# EasyEDA Pro project ProProject_ESP32S3-LVGL-DevelopmentBoard.epro

# Schematic Schematic1
Create Date: 2023-11-24; Page Name: P1; Project Name: ESP32-TFT3.2开发板; Schematic Name: Schematic1; Update Date: 2024-04-12; Company: 嘉立创EDA; Page Size: A4; Version: V1.0
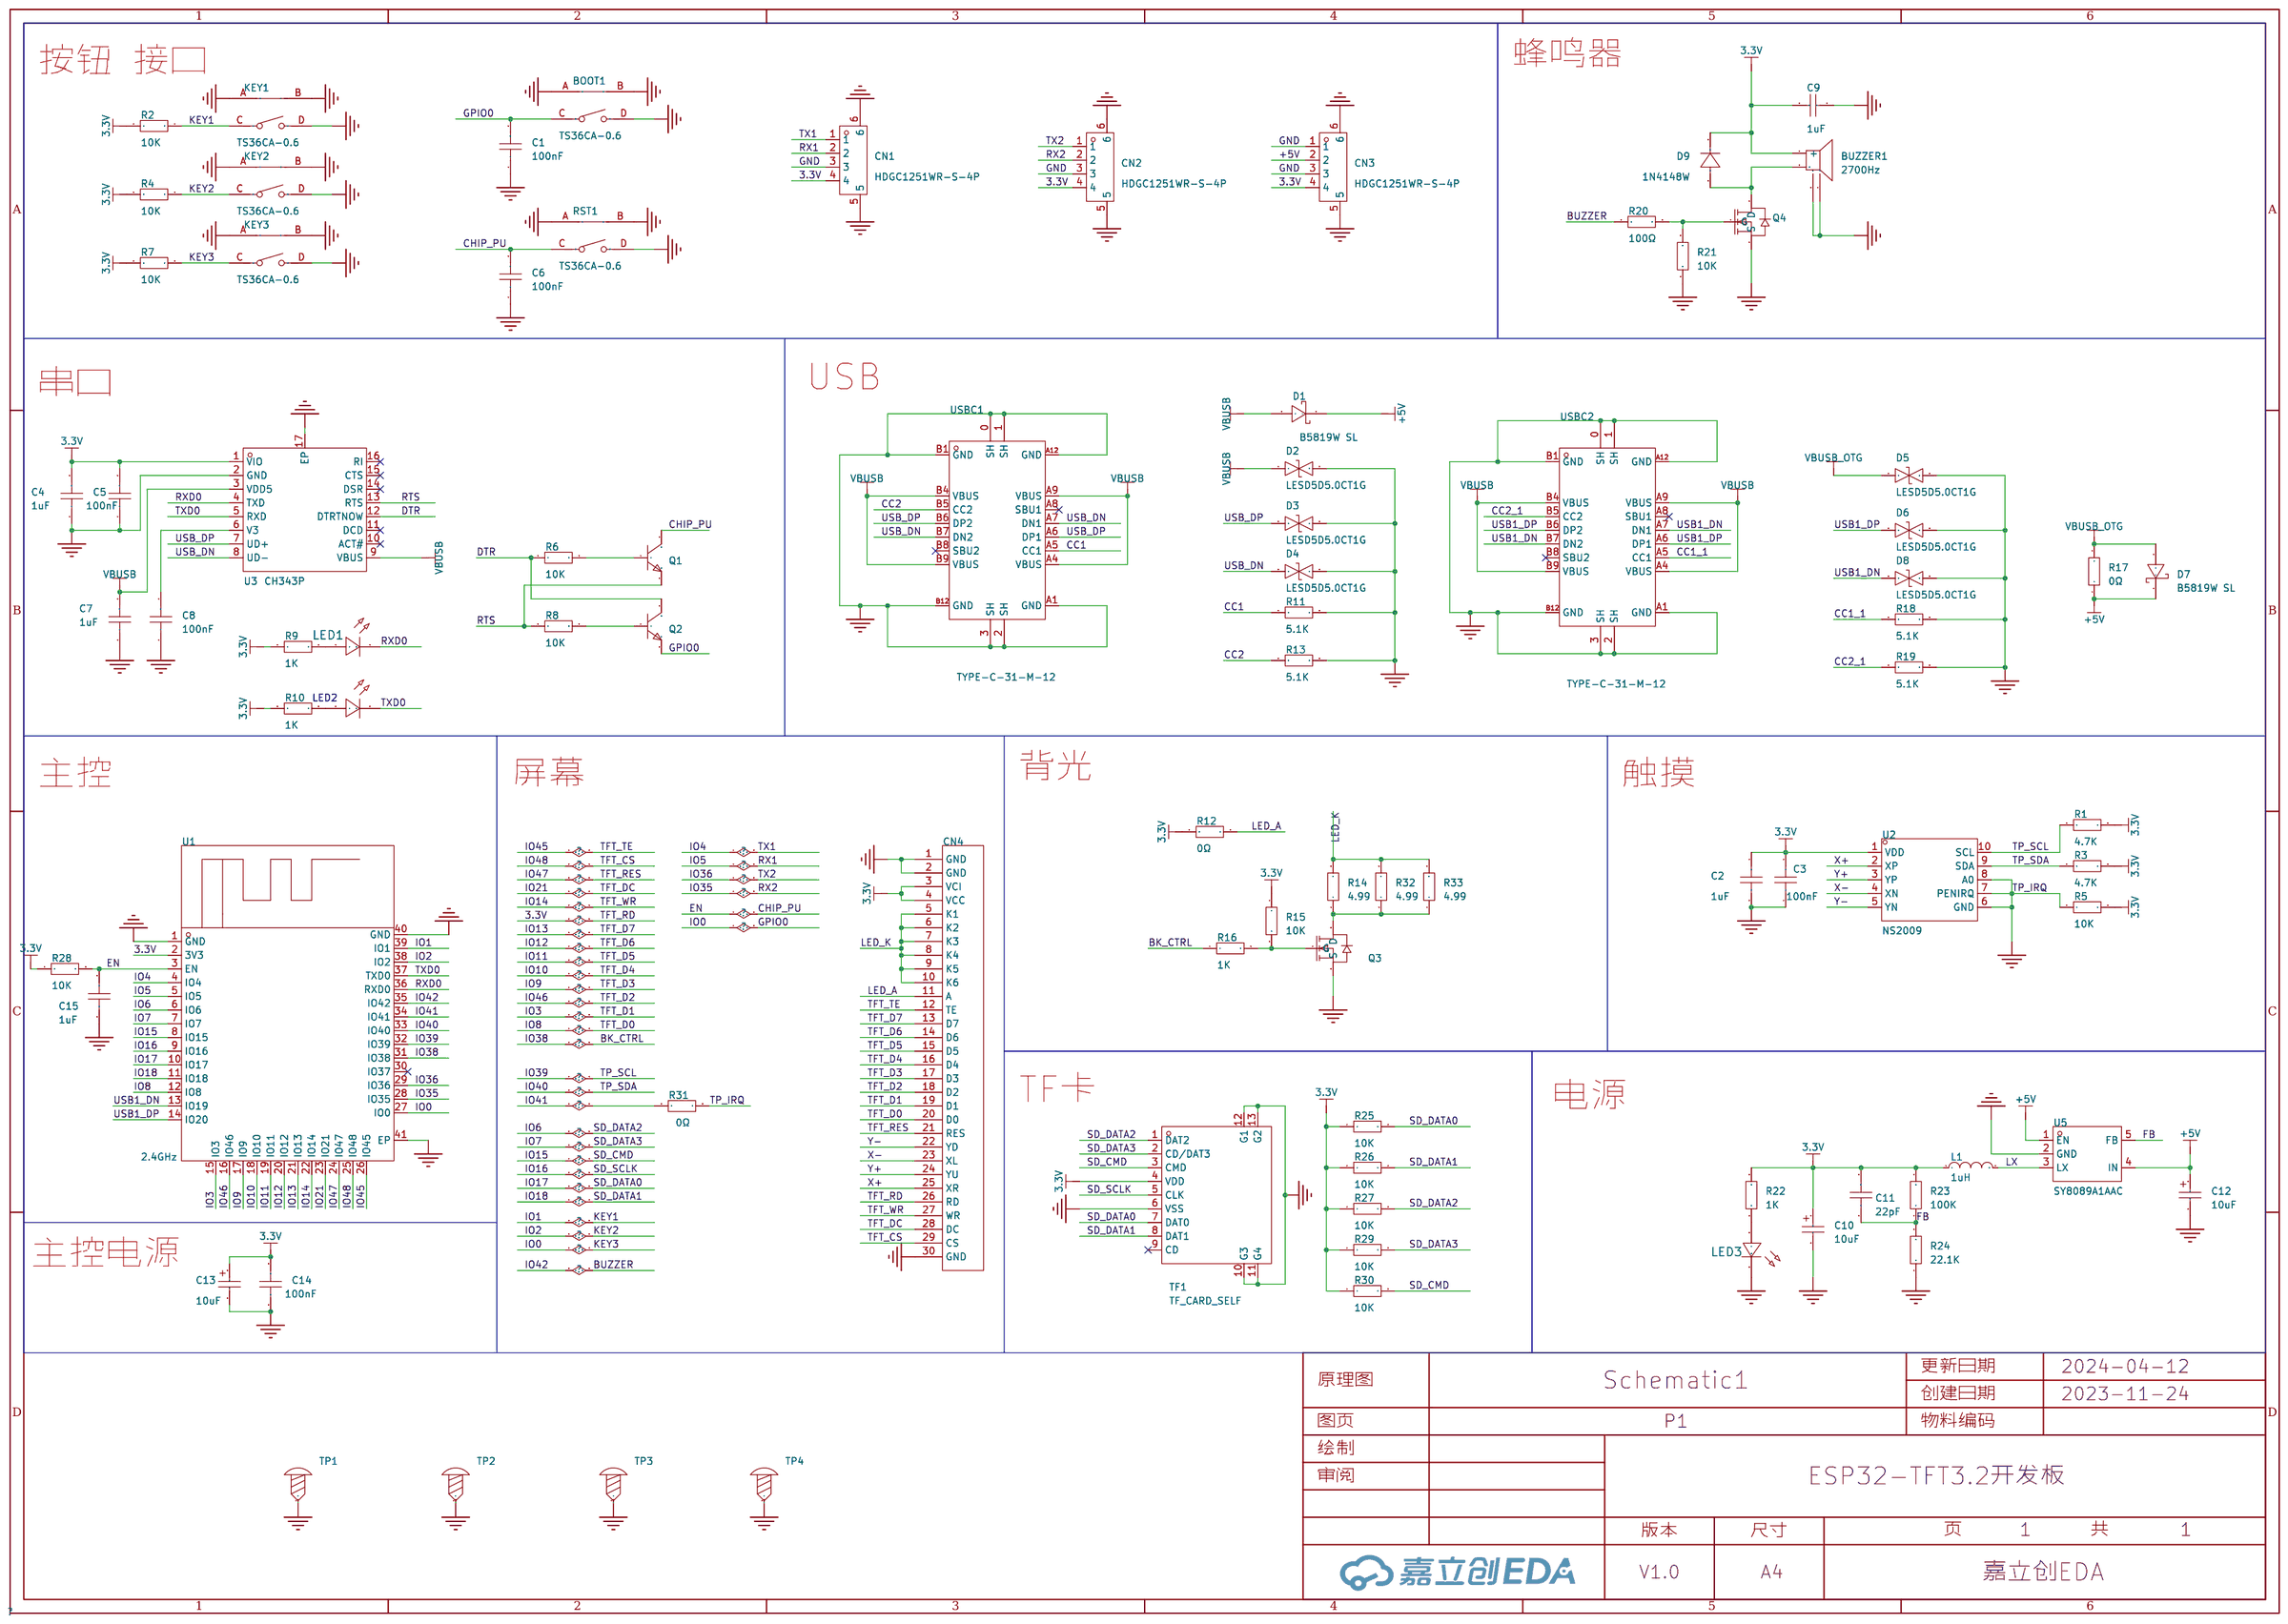
[diagram p0: schematic sheet]

## Parts
BOOT1  TS36CA-0.6  [SW-SMD_TS36CA]
BUZZER1  2700Hz  [BUZ-SMD_4P-L8.5-W8.5-P8.50-BR]
C1  100nF  [C0603]
C2  1uF  [C0603]
C3  100nF  [C0603]
C4  1uF  [C0603]
C5  100nF  [C0603]
C6  100nF  [C0603]
C7  1uF  [C0603]
C8  100nF  [C0603]
C9  1uF  [C0603]
C10  10uF  [CAP-SMD_L3.2-W1.6-RD-C7171]
C11  22pF  [C0603]
C12  10uF  [CAP-SMD_L3.2-W1.6-RD-C7171]
C13  10uF  [CAP-SMD_L3.2-W1.6-RD-C7171]
C14  100nF  [C0603]
C15  1uF  [C0603]
CN1  HDGC1251WR-S-4P  [CONN-SMD_4P-P1.25_HDGC-HDGC1251WR-S-4P]
CN2  HDGC1251WR-S-4P  [CONN-SMD_4P-P1.25_HDGC-HDGC1251WR-S-4P]
CN3  HDGC1251WR-S-4P  [CONN-SMD_4P-P1.25_HDGC-HDGC1251WR-S-4P]
CN4  -  [FPC032MRA003-V2]
D1  B5819W SL  [SOD-123_L2.7-W1.6-LS3.7-RD-1]
D2  LESD5D5.0CT1G  [SOD-523_L1.2-W0.8-LS1.6-BI]
D3  LESD5D5.0CT1G  [SOD-523_L1.2-W0.8-LS1.6-BI]
D4  LESD5D5.0CT1G  [SOD-523_L1.2-W0.8-LS1.6-BI]
D5  LESD5D5.0CT1G  [SOD-523_L1.2-W0.8-LS1.6-BI]
D6  LESD5D5.0CT1G  [SOD-523_L1.2-W0.8-LS1.6-BI]
D7  B5819W SL  [SOD-123_L2.7-W1.6-LS3.7-RD-1]
D8  LESD5D5.0CT1G  [SOD-523_L1.2-W0.8-LS1.6-BI]
D9  1N4148W  [SOD-123_L2.7-W1.6-LS3.7-RD-1]
KEY1  TS36CA-0.6  [SW-SMD_TS36CA]
KEY2  TS36CA-0.6  [SW-SMD_TS36CA]
KEY3  TS36CA-0.6  [SW-SMD_TS36CA]
L1  1uH  [IND-SMD_L2.5-W2.0-B]
LED1  -  [LED_0603]
LED2  -  [LED_0603]
LED3  -  [LED_0603]
Q1  -  [S8050_SOT-23]
Q2  -  [S8050_SOT-23]
Q3  -  [SOT-23-3_L2.9-W1.3-P1.90-LS2.4-BR]
Q4  -  [SOT-23-3_L2.9-W1.3-P1.90-LS2.4-BR]
R1  4.7K  [R0603]
R2  10K  [R0603]
R3  4.7K  [R0603]
R4  10K  [R0603]
R5  10K  [R0603]
R6  10K  [R0603]
R7  10K  [R0603]
R8  10K  [R0603]
R9  1K  [R0603]
R10  1K  [R0603]
R11  5.1K  [R0603]
R12  0Ω  [R0603]
R13  5.1K  [R0603]
R14  4.99  [R0603]
R15  10K  [R0603]
R16  1K  [R0603]
R17  0Ω  [R0603]
R18  5.1K  [R0603]
R19  5.1K  [R0603]
R20  100Ω  [R0603]
R21  10K  [R0603]
R22  1K  [R0603]
R23  100K  [R0603]
R24  22.1K  [R0603]
R25  10K  [R0603]
R26  10K  [R0603]
R27  10K  [R0603]
R28  10K  [R0603]
R29  10K  [R0603]
R30  10K  [R0603]
R31  0Ω  [R0603]
R32  4.99  [R0603]
R33  4.99  [R0603]
RST1  TS36CA-0.6  [SW-SMD_TS36CA]
TF1  TF_CARD_SELF  [TF-SMD_TF-15-15]
TP1  -  [M3螺丝]
TP2  -  [M3螺丝]
TP3  -  [M3螺丝]
TP4  -  [M3螺丝]
U1  2.4GHz  [WIFIM-SMD_ESP32-S3-WROOM-1-N8]
U2  NS2009  [MSOP-10_L3.0-W3.0-P0.50-LS5.0-BL]
U3  CH343P  [TQFN-16_L3.0-W3.0-P0.50-BL-EP1.7]
U5  SY8089A1AAC  [TSOT-23-5_L2.9-W1.6-P0.95-LS2.8-BR]
USBC1  TYPE-C-31-M-12  [USB-C_SMD-TYPE-C-31-M-12]
USBC2  TYPE-C-31-M-12  [USB-C_SMD-TYPE-C-31-M-12]

## Library data of the parts
BOOT1 KEY1-KEY3 RST1 = TS36CA-0.6: 触点电流:50mA;额定电压(DC):12V;绝缘电阻:100MΩ;电路结构:单刀单掷;安装方式:卧贴;按钮形状:矩形按钮;按钮/盖帽颜色:黑色;作用力:250gf@±50gf;机械寿命:30000;工作温度:-20℃~+70℃;引脚样式:SMD接片;开关高度:3.5mm;; LCSC Part Name: 轻触开关 3*6*3.5侧按 直径0.6定位柱 白体黑头 250力度; Supplier Part: C2681481; Manufacturer: SHOU HAN(首韩); Supplier Footprint: SMD; JLCPCB Part Class: 扩展库; Datasheet: https://atta.szlcsc.com/upload/public/pdf/source/20210122/C2681481_EC49E45AE97AC1474E58FB36E84EF19B.pdf; Supplier: LCSC; Contact Current: 50mA; Voltage Rating (DC): 12V; Insulation Resistance: 100MΩ; Circuit: 单刀单掷; Mounting Style: 卧贴; Actuator Style: 矩形按钮; Actuator/Cap Color: 黑色; Operating Force: 250gf@±50gf; Mechanical Life: 30000; Operating Temperature: -20℃~+70℃; Pin Style: SMD接片; Switch Height: 3.5mm
BUZZER1 = MLT-8530_C94599: 驱动方式:无源(外部驱动);构造类型:电磁式;额定电压:3.6V;工作电压:2.5V~4.5V;频率:2700Hz;声压(SPL):80dB@5V,10cm;长度:8.5mm;宽度:8.5mm;高度:3.3mm;; LCSC Part Name: MLT-8530; Supplier Part: C94599; Manufacturer: 华能; Manufacturer Part: MLT-8530; Supplier Footprint: SMD; JLCPCB Part Class: 扩展库; Datasheet: https://atta.szlcsc.com/upload/public/pdf/source/20170522/1495448322339.pdf; Supplier: LCSC; Oscillator Circuit: 无源(外部驱动); Technology Type: 电磁式; Rated Voltage: 3.6V; Operating Voltage: 2.5V~4.5V; Sound Pressure Level (SPL): 80dB@5V,10cm; Length: 8.5mm; Width: 8.5mm; Height: 3.3mm
C1-C8 C11 C15 = CAP_0603: Supplier Footprint: 0603
C9 = CL10A105KO8NNNC: 容值:1uF;精度:±10%;额定电压:16V;材质(温度系数):X5R;; LCSC Part Name: 1uF ±10% 16V; Supplier Part: C1592; Manufacturer: SAMSUNG(三星); Supplier Footprint: 0603; JLCPCB Part Class: 扩展库; Datasheet: https://atta.szlcsc.com/upload/public/pdf/source/20220919/9FBE606BE0D9532D730F292EB26DC5BB.pdf; Supplier: LCSC; Tolerance: ±10%; Voltage Rated: 16V; Temperature Coefficient: X5R
C10 C12 C13 = TAJA106K016RNJ: 容值:10uF;精度:±10%;额定电压:16V;等效串联电阻:3Ω@100kHz;; LCSC Part Name: 10uF ±10% 16V; Supplier Part: C7171; Manufacturer: Kyocera AVX; Supplier Footprint: CASE-A-3216; JLCPCB Part Class: 基础库; Datasheet: https://atta.szlcsc.com/upload/public/pdf/source/20160107/1457707748093.pdf; Supplier: LCSC; Tolerance: ±10%; Rated Voltage: 16V; Equivalent Series Resistance(ESR): 3Ω@100kHz; Operating Temperature: -55℃~+125℃
C14 = CC0603KRX7R9BB104: 容值:100nF;精度:±10%;额定电压:50V;材质(温度系数):X7R;; LCSC Part Name: 100nF ±10% 50V; Supplier Part: C14663; Manufacturer: YAGEO(国巨); Supplier Footprint: 0603; JLCPCB Part Class: 基础库; Datasheet: https://atta.szlcsc.com/upload/public/pdf/source/20180910/C282072_33301C7F631E79921B82A8DAC6BCC5B3.pdf; Supplier: LCSC; Tolerance: ±10%; Voltage Rated: 50V; Temperature Coefficient: X7R
CN1-CN3 = HDGC1251WR-S-4P: 插针结构:1x4P;间距:1.25mm;公母:公;安装方式:卧贴;行距:-;排数:1;每排PIN数:4;参考系列:-;额定电流:1A;工作温度范围:-25℃~+70℃;; LCSC Part Name: 1x4P 间距:1.25mm 卧贴; Supplier Part: C2936205; Manufacturer: HDGC(华德共创); Supplier Footprint: SMD,P=1.25mm; JLCPCB Part Class: 扩展库; Datasheet: https://atta.szlcsc.com/upload/public/pdf/source/20211224/39B2CD9909BA84C441A1A286C5C28FE5.pdf; Supplier: LCSC; Pins Structure: 1x4P; Pitch: 1.25mm; Gender: 公; Mounting Style: 卧贴; Number of Rows: 1; Number of PINs Per Row: 4; Current Rating (Max): 1A; Operating Temperature Range: -25℃~+70℃
CN4 = FPC032MRA003-V2: 3.2 寸液晶屏 30 Pin, r61581  320*480 MCU 8 Bits 带电阻屏; Check: false
D1 D7 = B5819W SL: 直流反向耐压(Vr):40V;平均整流电流(Io):1A;正向压降(Vf):600mV@1A;; LCSC Part Name: 40V 1A 600mV@1A; Supplier Part: C8598; Manufacturer: CJ(江苏长电/长晶); Supplier Footprint: SOD-123; JLCPCB Part Class: 基础库; Datasheet: https://atta.szlcsc.com/upload/public/pdf/source/20170217/1487301580783.pdf; Supplier: LCSC; Reverse Voltage (Vr): 40V; Average Rectified Current (Io): 1A; Forward Voltage (Vf@If): 600mV@1A
D2-D6 D8 = LESD5D5.0CT1G: 极性:双向;反向截止电压(Vrwm):5V;击穿电压(VBR):5.6V;钳位电压(Vc)@Ipp:18.6V;; LCSC Part Name: 双向ESD; Supplier Part: C383211; Manufacturer: LRC(乐山无线电); Supplier Footprint: SOD-523; JLCPCB Part Class: 扩展库; Datasheet: https://atta.szlcsc.com/upload/public/pdf/source/20190807/C383211_633DF4B4E2C161403226E5235FE33A1C.pdf; Supplier: LCSC; Polarity: 双向; Reverse Stand-Off Voltage (Vrwm): 5V; Breakdown Voltage (VBR): 5.6V; Peak Pulse Current(Ipp)@8/20us: 9.4A; Clamping Voltage@Ipp: 18.6V
D9 = 1N4148W: 二极管配置:-;功率:500mW;直流反向耐压(Vr):-;平均整流电流(Io):150mA;正向压降(Vf):1.25V@100mA;反向电流(Ir):5uA@75V;反向恢复时间(trr):4ns;工作温度:+150℃@(Tj);; LCSC Part Name: 150mA 4ns; Supplier Part: C2892570; Manufacturer: YONGYUTAI(永裕泰); Supplier Footprint: SOD-123; JLCPCB Part Class: 扩展库; Datasheet: https://atta.szlcsc.com/upload/public/pdf/source/20210906/424708ED2E76C29D36F058AA2585E916.pdf; Supplier: LCSC; Power Dissipation: 500mW; Average Rectified Current (Io): 150mA; Forward Voltage (Vf@If): 1.25V@100mA; Reverse Leakage Current: 5uA@75V; Reverse Recovery Time (trr): 4ns; Operating Temperature: +150℃@(Tj)
L1 = PIM252010-1R0MTS00: 类型:-;电感值:1uH;精度:±20%;额定电流:4.1A;饱和电流(Isat):-;; LCSC Part Name: 1uH ±20% 4.1A 30mΩ; Supplier Part: C2986790; Manufacturer: FH(风华); Supplier Footprint: SMD,2.5x2x1mm; JLCPCB Part Class: 扩展库; Datasheet: https://atta.szlcsc.com/upload/public/pdf/source/20220412/F9C223B3E3BB425973BA14529C55B246.pdf; Supplier: LCSC; Tolerance: ±20%; Rated Current: 4.1A; DC Resistance (DCR): 30mΩ
LED1 LED3 = LED_0603-R: Supplier Footprint: 0603
LED2 = LED_0603-G: Supplier Footprint: 0603
Q1 Q2 = S8050_SOT_NPN: Supplier Footprint: SOT-23
Q3 Q4 = AO3400A_N: 类型:N沟道;漏源电压(Vdss):30V;连续漏极电流(Id):5.2A;功率(Pd):1W;导通电阻(RDS(on)@Vgs,Id):35mΩ@10V,5A;阈值电压(Vgs(th)@Id):1.5V@250μA;; Supplier Footprint: SOT-23; Supplier Part: C700953
R1-R19 R22-R33 = Res_0603: Supplier Footprint: 0603
R20 = RC0603FR-07100RL: 电阻类型:厚膜电阻;阻值:100Ω;精度:±1%;功率:100mW;; LCSC Part Name: 100Ω ±1% 100mW; Supplier Part: C105588; Manufacturer: YAGEO(国巨); Supplier Footprint: 0603; JLCPCB Part Class: 扩展库; Datasheet: https://atta.szlcsc.com/upload/public/pdf/source/20170428/1493376742308.pdf; Supplier: LCSC; Type: 厚膜电阻; Tolerance: ±1%; Power(Watts): 100mW; Temperature Coefficient: ±100ppm/℃; Overload Voltage (Max): 75V; Operating Temperature Range: -55℃~+155℃
R21 = 0603WAF1002T5E: 阻值:10kΩ;精度:±1%;功率:100mW;温度系数:±100ppm/℃;电阻类型:厚膜电阻;; LCSC Part Name: 10kΩ ±1% 100mW 厚膜电阻; Supplier Part: C25804; Manufacturer: UNI-ROYAL(厚声); Supplier Footprint: 0603; JLCPCB Part Class: 基础库; Datasheet: https://atta.szlcsc.com/upload/public/pdf/source/20200306/C422600_1E6D84923E4A46A82E41ADD87F860B5C.pdf; Supplier: LCSC; Tolerance: ±1%; Power(Watts): 100mW; Overload Voltage (Max): 75V; Temperature Coefficient: ±100ppm/℃; Type: 厚膜电阻; Operating Temperature Range: -55℃~+155℃
TF1 = TF_CARD_SELF: Supplier Part: C9900010414; Supplier Footprint: TFCARD; JLCPCB Part Class: 扩展库; Datasheet: https://atta.szlcsc.comnull; Supplier: LCSC
TP1-TP4 = M3螺丝: Supplier Footprint: 插件
U1 = ESP32-S3-WROOM-1-N8: 核心处理器:ESP32-S3芯片;频率:2.4GHz;; LCSC Part Name: 通用型Wi-Fi+低功耗蓝牙MCU模组; Supplier Part: C2913198; Manufacturer: ESPRESSIF(乐鑫); Supplier Footprint: SMD,18x25.5mm; Datasheet: https://atta.szlcsc.com/upload/public/pdf/source/20221026/9A44C6421221D672346AAE72DF9F8146.pdf; Supplier: LCSC; Core Processor: ESP32-S3芯片; Support Interface: I2C；GPIO；SPI；PWM；ADC；UART；USB；I2S
U2 = NS2009: 4线电阻触摸屏控制器，I2C接口; Supplier Part: C219024; Manufacturer: Nsiway(纳芯威); Supplier Footprint: MSOP-10; JLCPCB Part Class: 扩展库; Datasheet: https://atta.szlcsc.com/upload/public/pdf/source/20180621/C219024_19B489E3E2E7317F61938E8C48020F1E.PDF; Supplier: LCSC
U3 = CH343P: 应用功能:-;接口协议:-;; Supplier Part: C2846043; Manufacturer: WCH(南京沁恒); Supplier Footprint: TQFN-16-EP(3x3); JLCPCB Part Class: 扩展库; Datasheet: https://atta.szlcsc.com/upload/public/pdf/source/20211010/C2846043_7FA705E1F14A2906F6A2AFA45FA28209.pdf; Supplier: LCSC
U5 = SY8089A1AAC: Supplier Part: C479074; Manufacturer: silergy(矽力杰); Supplier Footprint: SOT-23-5; JLCPCB Part Class: 扩展库; Datasheet: https://atta.szlcsc.com/upload/public/pdf/source/20200117/C479074_09E605B8BDE11DB5A08573B7E6429A0D.pdf; Supplier: LCSC
USBC1 USBC2 = TYPE-C-31-M-12: 连接器类型:Type-C;标准:-;公母:母;触点数量:16P;端口数量:1;安装方式:-;额定电流 - 电源:5A;触头材质:-;触头镀层:-;工作温度范围:-;焊接温度(最大值):-;; LCSC Part Name: Type-C 母; Supplier Part: C165948; Manufacturer: 韩国韩荣; Supplier Footprint: SMD; JLCPCB Part Class: 扩展库; Datasheet: https://atta.szlcsc.com/upload/public/pdf/source/20220525/466408E853115E789EDB0DDC29077C05.pdf; Supplier: LCSC; Connector Type: Type-C; Gender: 母; Number of Contacts: 16P; Number of Ports: 1; Current Rating - Power (Max): 5A

## Nets
3.3V: BUZZER1.1(+) C2.1 C3.2 C4.2 C5.2 C9.1 C10.1 C11.2 C13.1 C14.2 CN1.4 CN2.4 CN3.4 CN4.3(VCI) CN4.4(VCC) CN4.26(RD) D9.1(K) L1.1 R1.2 R2.1 R3.2 R4.1 R5.2 R7.1 R9.1 R10.1 R12.1 R15.1 R22.2 R23.2 R25.1 R26.1 R27.1 R28.1 R29.1 R30.1 TF1.4(VDD) U1.2(3V3) U2.1(VDD) U3.1(VIO)
+5V: C12.1 CN3.2 D1.1(-) D7.1(-) R17.1 U5.1(EN) U5.4(IN)
GND: BOOT1.A BOOT1.B BOOT1.D BUZZER1.3 BUZZER1.4 C1.1 C2.2 C3.1 C4.1 C5.1 C6.1 C7.1 C8.1 C9.2 C10.2 C12.2 C13.2 C14.1 C15.1 CN1.3 CN1.5 CN1.6 CN2.3 CN2.5 CN2.6 CN3.1 CN3.3 CN3.5 CN3.6 CN4.1(GND) CN4.2(GND) CN4.30(GND) D2.2 D3.2 D4.2 D5.2 D6.2 D8.2 KEY1.A KEY1.B KEY1.D KEY2.A KEY2.B KEY2.D KEY3.A KEY3.B KEY3.D LED3.1(C) Q3.2(S) Q4.2(S) R11.2 R13.2 R18.2 R19.2 R21.1 R24.1 RST1.A RST1.B RST1.D TF1.6(VSS) TF1.10(G3) TF1.11(G4) TF1.12(G1) TF1.13(G2) TP1.1 TP2.1 TP3.1 TP4.1 U1.1(GND) U1.40(GND) U1.41(EP) U2.6(GND) U2.8(A0) U3.2(GND) U3.17(EP) U5.2(GND) USBC1.0(SH) USBC1.1(SH) USBC1.2(SH) USBC1.3(SH) USBC1.A1(GND) USBC1.A12(GND) USBC1.B1(GND) USBC1.B12(GND) USBC2.0(SH) USBC2.1(SH) USBC2.2(SH) USBC2.3(SH) USBC2.A1(GND) USBC2.A12(GND) USBC2.B1(GND) USBC2.B12(GND)
VBUSB: C7.2 D1.2(+) D2.1 U3.3(VDD5) U3.9(VBUS) USBC1.A4(VBUS) USBC1.A9(VBUS) USBC1.B4(VBUS) USBC1.B9(VBUS) USBC2.A4(VBUS) USBC2.A9(VBUS) USBC2.B4(VBUS) USBC2.B9(VBUS)
VBUSB_OTG: D5.1 D7.2(+) R17.2
BK_CTRL: R16.1 U1.31(IO38)
BUZZER: R20.1 U1.35(IO42)
CC1: R11.1 USBC1.A5(CC1)
CC1_1: R18.1 USBC2.A5(CC1)
CC2: R13.1 USBC1.B5(CC2)
CC2_1: R19.1 USBC2.B5(CC2)
CHIP_PU: C6.2 C15.2 Q1.3 R28.2 RST1.C U1.3(EN)
DTR: Q2.3 R6.1 U3.12(DTRTNOW)
FB: C11.1 R23.1 R24.2 U5.5(FB)
GPIO0: BOOT1.C C1.2 KEY3.C Q2.2 R7.2 U1.27(IO0)
IO1: KEY1.C R2.2 U1.39(IO1)
IO2: KEY2.C R4.2 U1.38(IO2)
IO3: CN4.19(D1) U1.15(IO3)
IO4: CN1.1 U1.4(IO4)
IO5: CN1.2 U1.5(IO5)
IO6: R27.2 TF1.1(DAT2) U1.6(IO6)
IO7: R29.2 TF1.2(CD/DAT3) U1.7(IO7)
IO8: CN4.20(D0) U1.12(IO8)
IO9: CN4.17(D3) U1.17(IO9)
IO10: CN4.16(D4) U1.18(IO10)
IO11: CN4.15(D5) U1.19(IO11)
IO12: CN4.14(D6) U1.20(IO12)
IO13: CN4.13(D7) U1.21(IO13)
IO14: CN4.27(WR) U1.22(IO14)
IO15: R30.2 TF1.3(CMD) U1.8(IO15)
IO16: TF1.5(CLK) U1.9(IO16)
IO17: R25.2 TF1.7(DAT0) U1.10(IO17)
IO18: R26.2 TF1.8(DAT1) U1.11(IO18)
IO21: CN4.28(DC) U1.23(IO21)
IO35: CN2.2 U1.28(IO35)
IO36: CN2.1 U1.29(IO36)
IO39: R1.1 U1.32(IO39) U2.10(SCL)
IO40: R3.1 U1.33(IO40) U2.9(SDA)
IO41: R31.1 U1.34(IO41)
IO45: CN4.12(TE) U1.26(IO45)
IO46: CN4.18(D2) U1.16(IO46)
IO47: CN4.21(RES) U1.24(IO47)
IO48: CN4.29(CS) U1.25(IO48)
LED_A: CN4.11(A) R12.2
LED_K: CN4.5(K1) CN4.6(K2) CN4.7(K3) CN4.8(K4) CN4.9(K5) CN4.10(K6) R14.2 R32.2 R33.2
LX: L1.2 U5.3(LX)
RTS: Q1.2 R8.1 U3.13(RTS)
RXD0: LED1.1(C) U1.36(RXD0) U3.4(TXD)
TP_IRQ: R5.1 R31.2 U2.7(PENIRQ)
TXD0: LED2.1(C) U1.37(TXD0) U3.5(RXD)
USB1_DN: D8.1 U1.13(IO19) USBC2.A7(DN1) USBC2.B7(DN2)
USB1_DP: D6.1 U1.14(IO20) USBC2.A6(DP1) USBC2.B6(DP2)
USB_DN: D4.1 U3.8(UD-) USBC1.A7(DN1) USBC1.B7(DN2)
USB_DP: D3.1 U3.7(UD+) USBC1.A6(DP1) USBC1.B6(DP2)
X+: CN4.25(XR) U2.2(XP)
X-: CN4.23(XL) U2.4(XN)
Y+: CN4.24(YU) U2.3(YP)
Y-: CN4.22(YD) U2.5(YN)
$1N3208: BUZZER1.2 D9.2(A) Q4.3(D)
$1N3424: Q4.1(G) R20.2 R21.2
$1N5196: C8.2 U3.6(V3)
$1N5808: Q2.1 R8.2
$1N5811: Q1.1 R6.2
$1N5919: LED1.2(A) R9.2
$1N6009: LED2.2(A) R10.2
$1N10155: Q3.1(G) R15.2 R16.2
$1N10331: Q3.3(D) R14.1 R32.1 R33.1
$1N12322: LED3.2(A) R22.1

Not connected (* = marked no-connect by the designer): TF1 9(CD)*; U1 30(IO37)*; U3 10(ACT#)* 11(DCD)* 14(DSR)* 15(CTS)* 16(RI)*; USBC1 A8(SBU1)* B8(SBU2)*; USBC2 A8(SBU1)* B8(SBU2)*

## Notes on the sheet
- 按钮 接口
- 蜂鸣器
- 串口
- USB
- 主控
- 屏幕
- 背光
- 触摸
- TF卡
- 电源
- 主控电源

# Board PCB1
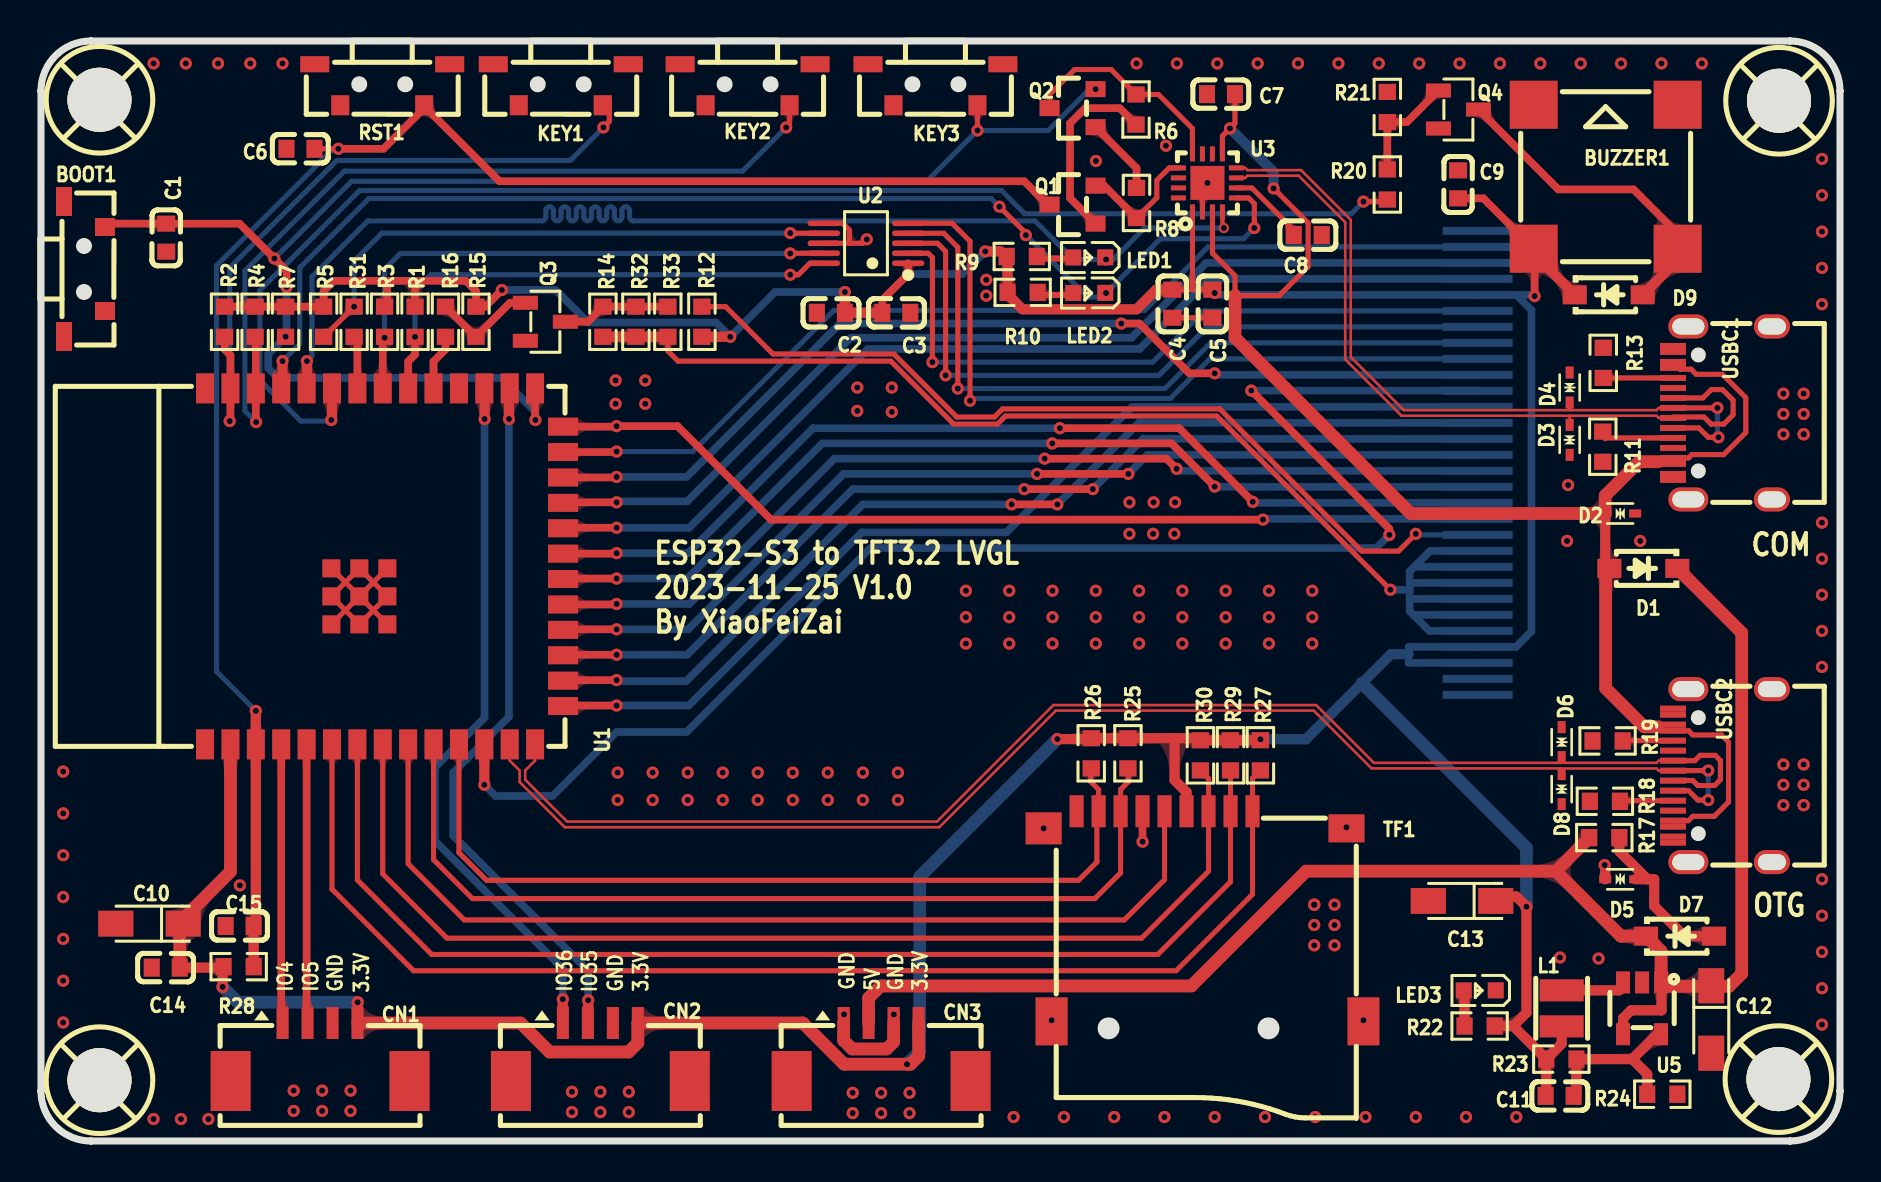
[diagram p1: board, top side]
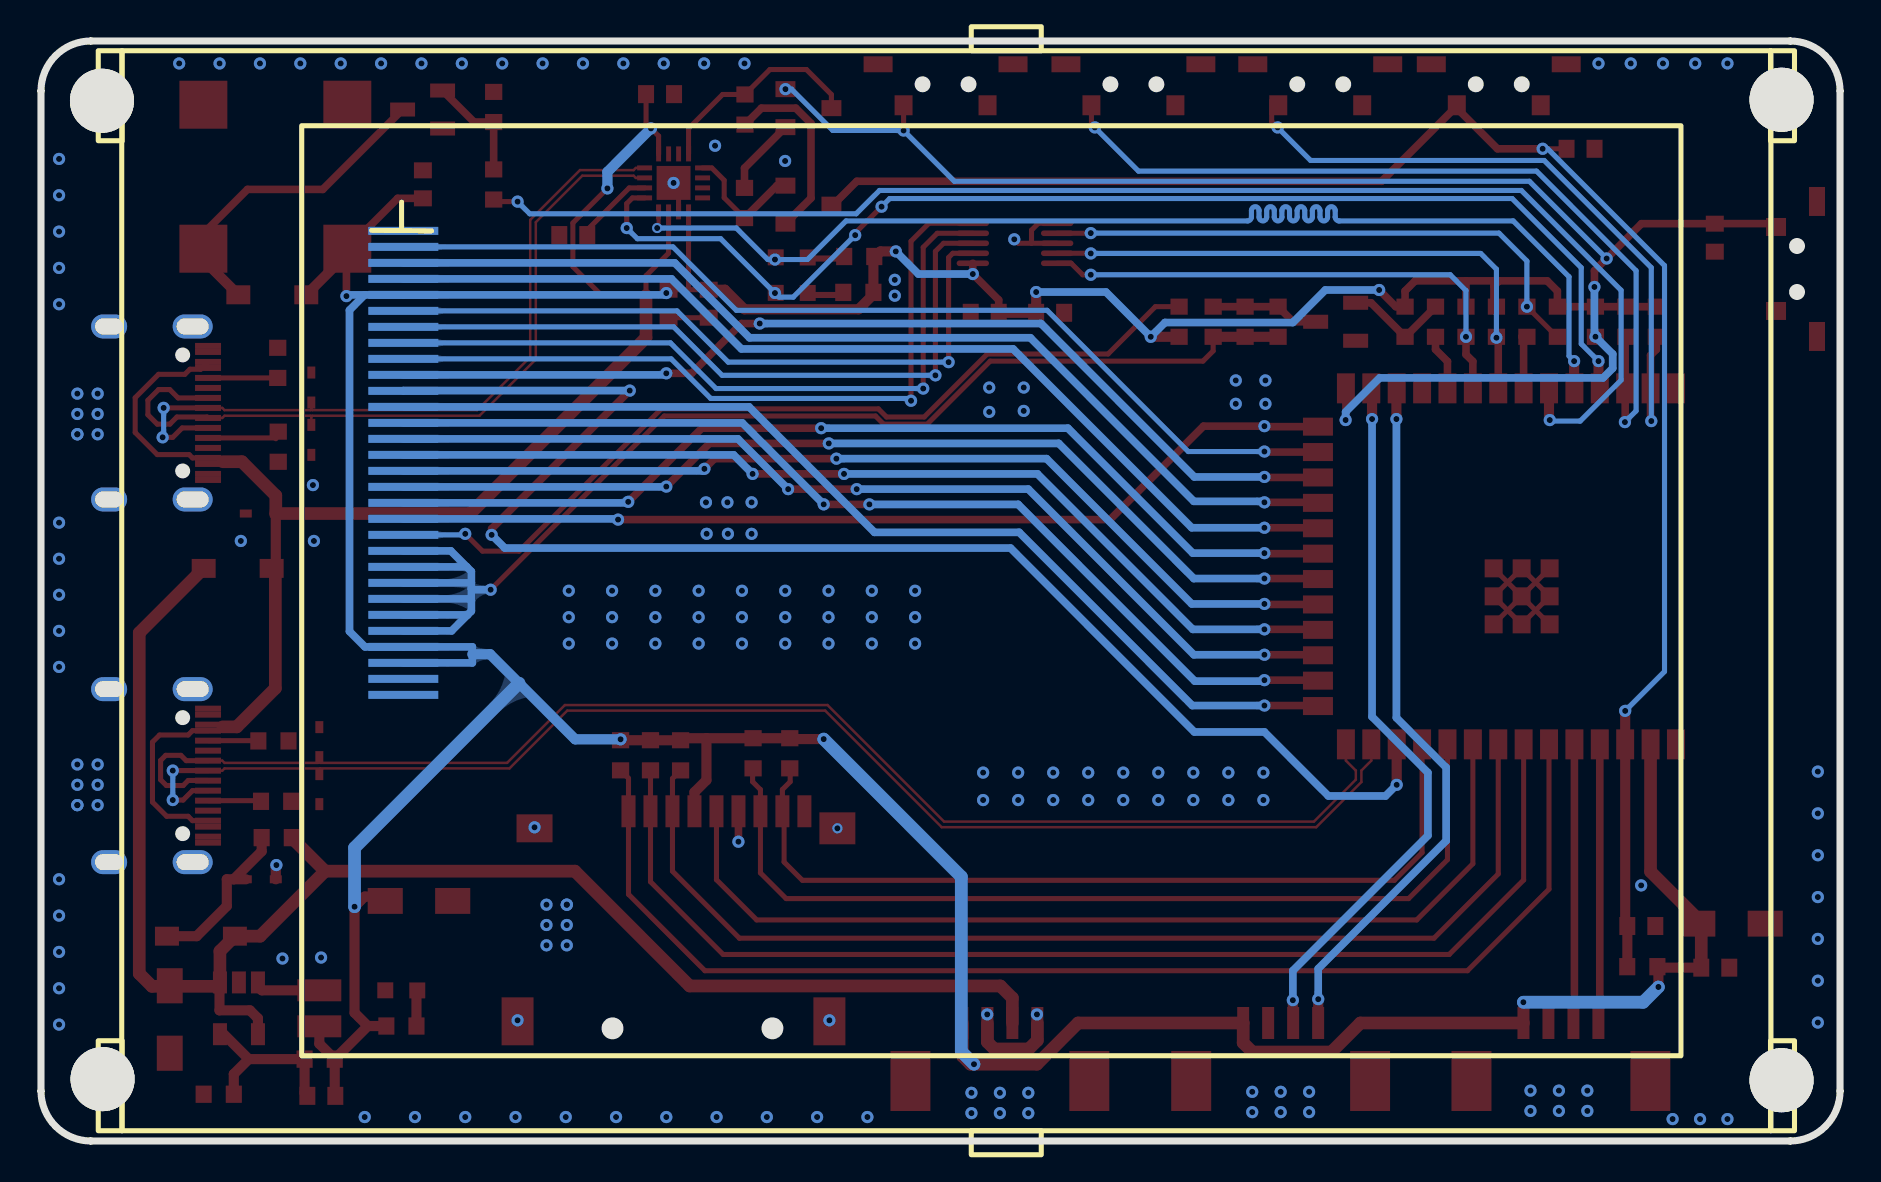
[diagram p2: board, bottom side, seen from below]

Outline 90.1 x 55.1 mm; copper layers: Top Layer, Bottom Layer. Coordinates in mm from the lower left corner of the outline.
Outline path: 0,52.55 arc(0.01,52.59) 0.05,52.6 arc(0.09,52.59) 0.1,52.55 ; 0,52.55 arc(0.75,54.35) 2.55,55.1 ; 0,52.55 0,2.55 ; 0,52.55 arc(0.01,52.51) 0.05,52.5 arc(0.09,52.51) 0.1,52.55 ; 2.55,55.1 arc(2.51,55.09) 2.5,55.05 arc(2.51,55.01) 2.55,55 ; 2.55,55.1 arc(2.59,55.09) 2.6,55.05 arc(2.59,55.01) 2.55,55 ; 2.55,55.1 87.55,55.1 ; 0,2.55 arc(0.01,2.59) 0.05,2.6 arc(0.09,2.59) 0.1,2.55 ; 0,2.55 arc(0.01,2.51) 0.05,2.5 arc(0.09,2.51) 0.1,2.55 ; 0,2.55 arc(0.75,0.75) 2.55,0 ; 0.1,52.55 0.1,2.55 ; 0.1,52.55 arc(0.82,54.28) 2.55,55 ; 0.1,2.55 arc(0.82,0.82) 2.55,0.1 ; 2.55,55 87.55,55 ; 2.55,0.1 arc(2.51,0.09) 2.5,0.05 arc(2.51,0.01) 2.55,0 ; 2.55,0.1 arc(2.59,0.09) 2.6,0.05 arc(2.59,0.01) 2.55,0 ; 2.55,0.1 87.55,0.1 ; 87.55,55.1 arc(87.51,55.09) 87.5,55.05 arc(87.51,55.01) 87.55,55 ; 87.55,55.1 arc(87.58,55.09) 87.6,55.05 arc(87.58,55.01) 87.55,55 ; 87.55,55.1 arc(89.35,54.35) 90.1,52.55 ; 87.55,0.1 arc(87.51,0.09) 87.5,0.05 arc(87.51,0.01) 87.55,0 ; 87.55,0.1 arc(87.58,0.09) 87.6,0.05 arc(87.58,0.01) 87.55,0 ; 87.55,0.1 arc(89.28,0.82) 90,2.55 ; 2.55,0 87.55,0 ; 90.1,52.55 arc(90.08,52.59) 90.05,52.6 arc(90.01,52.59) 90,52.55 ; 90.1,52.55 arc(90.08,52.51) 90.05,52.5 arc(90.01,52.51) 90,52.55 ; 90.1,52.55 90.1,2.55 ; 87.55,55 arc(89.28,54.28) 90,52.55 ; 90,52.55 90,2.55 ; 87.55,0 arc(89.35,0.75) 90.1,2.55 ; 90,2.55 arc(90.01,2.59) 90.05,2.6 arc(90.08,2.59) 90.1,2.55 ; 90,2.55 arc(90.01,2.51) 90.05,2.5 arc(90.08,2.51) 90.1,2.55
Stack: Top Layer 0.035mm / Dielectric1 1.51mm FR4 er 4.5 / Bottom Layer 0.035mm

## Design rules (mm)
net USB1_DN: DP3
net USB1_DP: DP3
net RXD0: DP1
net TXD0: DP1
net USB_DP: DP2
net USB_DN: DP2
template: JLCPCB Capability(Two Layers Board)
spacing copperThickness1oz (default): track to track 0.102, other pairs 0.152 to 0.3
spacing copperThickness2oz: track to track 0.203, other pairs 0.152 to 0.3
track width copperThickness1oz (default): min 0.127, default 0.254, max 2.54
track width copperThickness2oz: min 0.203, default 0.254, max 2.54
differential pair differentialPair (default): width min 0.127, default 0.254, max 2.54; gap min 0.152, default 0.152
via viaSize (default): diameter min 0.5, default 0.61, max 10; hole min 0.3, default 0.305, max 6.3

## Placement (name value [footprint] x y rotation side)
BOOT1  TS36CA-0.6  [SW-SMD_TS36CA]  2.23 43.65 270 top
BUZZER1  2700Hz  [BUZ-SMD_4P-L8.5-W8.5-P8.50-BR]  78.33 48.26 0 top
C1  100nF  [C0603]  6.32 45.22 90 top
C2  1uF  [C0603]  39.56 41.46 180 top
C3  100nF  [C0603]  42.84 41.46 180 top
C4  1uF  [C0603]  56.65 41.91 90 top
C5  100nF  [C0603]  58.65 41.91 90 top
C6  100nF  [C0603]  13.03 49.66 0 top
C7  1uF  [C0603]  59.08 52.39 0 top
C8  100nF  [C0603]  63.42 45.35 180 top
C9  1uF  [C0603]  70.94 47.88 90 top
C10  10uF  [CAP-SMD_L3.2-W1.6-RD-C7171]  5.48 10.92 180 top
C11  22pF  [C0603]  76.03 2.31 180 top
C12  10uF  [CAP-SMD_L3.2-W1.6-RD-C7171]  83.61 6.13 270 top
C13  10uF  [CAP-SMD_L3.2-W1.6-RD-C7171]  71.14 12.05 180 top
C14  100nF  [C0603]  6.29 8.72 0 top
C15  1uF  [C0603]  9.99 10.8 0 top
CN1  HDGC1251WR-S-4P  [CONN-SMD_4P-P1.25_HDGC-HDGC1251WR-S-4P]  14.01 4.5 0 top
CN2  HDGC1251WR-S-4P  [CONN-SMD_4P-P1.25_HDGC-HDGC1251WR-S-4P]  28.03 4.5 0 top
CN3  HDGC1251WR-S-4P  [CONN-SMD_4P-P1.25_HDGC-HDGC1251WR-S-4P]  42.08 4.5 0 top
CN4  -  [FPC032MRA003-V2]  45.51 27.56 0 bottom
D1  B5819W SL  [SOD-123_L2.7-W1.6-LS3.7-RD-1]  80.21 28.68 180 top
D2  LESD5D5.0CT1G  [SOD-523_L1.2-W0.8-LS1.6-BI]  79.05 31.42 0 top
D3  LESD5D5.0CT1G  [SOD-523_L1.2-W0.8-LS1.6-BI]  76.53 35.11 270 top
D4  LESD5D5.0CT1G  [SOD-523_L1.2-W0.8-LS1.6-BI]  76.53 37.72 90 top
D5  LESD5D5.0CT1G  [SOD-523_L1.2-W0.8-LS1.6-BI]  79.05 13.14 180 top
D6  LESD5D5.0CT1G  [SOD-523_L1.2-W0.8-LS1.6-BI]  76.13 19.99 90 top
D7  B5819W SL  [SOD-123_L2.7-W1.6-LS3.7-RD-1]  82.05 10.29 0 top
D8  LESD5D5.0CT1G  [SOD-523_L1.2-W0.8-LS1.6-BI]  76.13 17.64 270 top
D9  1N4148W  [SOD-123_L2.7-W1.6-LS3.7-RD-1]  78.48 42.36 0 top
KEY1  TS36CA-0.6  [SW-SMD_TS36CA]  26.05 52.86 180 top
KEY2  TS36CA-0.6  [SW-SMD_TS36CA]  35.4 52.86 180 top
KEY3  TS36CA-0.6  [SW-SMD_TS36CA]  44.8 52.86 180 top
L1  1uH  [IND-SMD_L2.5-W2.0-B]  76.13 6.68 90 top
LED1  -  [LED_0603]  52.44 44.22 180 top
LED2  -  [LED_0603]  52.44 42.45 180 top
LED3  -  [LED_0603]  71.98 7.57 180 top
Q1  -  [S8050_SOT-23]  51.66 46.74 0 top
Q2  -  [S8050_SOT-23]  51.66 51.57 0 top
Q3  -  [SOT-23-3_L2.9-W1.3-P1.90-LS2.4-BR]  25.28 41.01 180 top
Q4  -  [SOT-23-3_L2.9-W1.3-P1.90-LS2.4-BR]  70.96 51.62 180 top
R1  4.7K  [R0603]  18.76 41.01 90 top
R2  10K  [R0603]  9.24 41.01 270 top
R3  4.7K  [R0603]  17.24 41.01 90 top
R4  10K  [R0603]  10.76 41.01 270 top
R5  10K  [R0603]  14.19 41.01 90 top
R6  10K  [R0603]  54.83 51.62 270 top
R7  10K  [R0603]  12.29 41.01 270 top
R8  10K  [R0603]  54.86 46.95 90 top
R9  1K  [R0603]  49.12 44.28 0 top
R10  1K  [R0603]  49.16 42.48 0 top
R11  5.1K  [R0603]  78.18 34.77 270 top
R12  0Ω  [R0603]  33.11 41.01 90 top
R13  5.1K  [R0603]  78.21 38.96 90 top
R14  4.99  [R0603]  28.16 41.01 270 top
R15  10K  [R0603]  21.81 41.01 270 top
R16  1K  [R0603]  20.29 41.01 90 top
R17  0Ω  [R0603]  78.26 15.22 0 top
R18  5.1K  [R0603]  78.29 17.04 180 top
R19  5.1K  [R0603]  78.42 20.05 180 top
R20  100Ω  [R0603]  67.4 47.88 90 top
R21  10K  [R0603]  67.4 51.75 270 top
R22  1K  [R0603]  72.02 5.8 0 top
R23  100K  [R0603]  76.11 4.14 180 top
R24  22.1K  [R0603]  81.16 2.39 180 top
R25  10K  [R0603]  54.43 19.44 270 top
R26  10K  [R0603]  52.59 19.44 270 top
R27  10K  [R0603]  61.05 19.34 270 top
R28  10K  [R0603]  9.94 8.77 0 top
R29  10K  [R0603]  59.56 19.34 270 top
R30  10K  [R0603]  58.05 19.33 270 top
R31  0Ω  [R0603]  15.71 41.01 90 top
R32  4.99  [R0603]  29.81 41.01 270 top
R33  4.99  [R0603]  31.41 41.01 270 top
RST1  TS36CA-0.6  [SW-SMD_TS36CA]  17.12 52.86 180 top
TF1  TF_CARD_SELF  [TF-SMD_TF-15-15]  58.21 11.29 270 top
TP1  -  [M3螺丝]  87.03 3.08 0 top
TP2  -  [M3螺丝]  87.06 52 0 top
TP3  -  [M3螺丝]  3.04 3.03 0 top
TP4  -  [M3螺丝]  3.04 52.05 0 top
U1  2.4GHz  [WIFIM-SMD_ESP32-S3-WROOM-1-N8]  17.21 28.78 90 top
U2  NS2009  [MSOP-10_L3.0-W3.0-P0.50-LS5.0-BL]  41.32 44.94 90 top
U3  CH343P  [TQFN-16_L3.0-W3.0-P0.50-BL-EP1.7]  58.4 47.95 0 top
U5  SY8089A1AAC  [TSOT-23-5_L2.9-W1.6-P0.95-LS2.8-BR]  80.15 6.68 90 top
USBC1  TYPE-C-31-M-12  [USB-C_SMD-TYPE-C-31-M-12]  84.17 36.45 90 top
USBC2  TYPE-C-31-M-12  [USB-C_SMD-TYPE-C-31-M-12]  84.17 18.32 90 top

## Footprints (pads in the part's own frame, mm; a bottom-side part is the same pattern mirrored in y, then rotated)
BUZ-SMD_4P-L8.5-W8.5-P8.50-BR
  rect 2.4x2.4 smd: 1(-3.6,-3.6) 2(3.6,-3.6) 3(3.599,3.599) 4(-3.6,3.6)
C0603
  rect 0.8x0.9 smd: 1(-0.7,0) 2(0.7,0)
CAP-SMD_L3.2-W1.6-RD-C7171
  rect 1.758x1.296 smd: 1(-1.687,0) 2(1.687,0)
CONN-SMD_4P-P1.25_HDGC-HDGC1251WR-S-4P
  rect 0.6x1.6 smd: 1(-1.875,1.45) 2(-0.625,1.45) 3(0.625,1.45) 4(1.875,1.45)
  rect 2x3 smd: 5(4.475,-1.45) 6(-4.475,-1.45)
FPC032MRA003-V2
  rect 3.5x0.4 smd: 1(26.416,5.207) 2(26.416,4.407) 3(26.416,3.607) 4(26.416,2.807) 5(26.416,2.007) 6(26.416,1.207) 7(26.416,0.407) 8(26.416,-0.393) 9(26.416,-1.193) 10(26.416,-1.993) 11(26.416,-2.793) 12(26.416,-3.593) 13(26.416,-4.393) 14(26.416,-5.193) 15(26.416,-5.993) 16(26.416,-6.793) 17(26.416,-7.593) 18(26.416,-8.393) 19(26.416,-9.193) 20(26.416,-9.993) 21(26.416,-10.793) 22(26.416,-11.593) 23(26.416,-12.393) 24(26.416,-13.193) 25(26.416,-13.993) 26(26.416,-14.793) 27(26.416,-15.593) 28(26.416,-16.393) 29(26.416,-17.193) 30(26.416,-17.993)
IND-SMD_L2.5-W2.0-B
  rect 1.1x2.2 smd: 1(-0.9,0) 2(0.9,0)
LED_0603
  rect 0.8x0.8 smd: 1(-0.851,-0.01) 2(0.75,-0.005)
M3螺丝
  round 3.2 hole 3.2: 1(-0.064,0.064)
MSOP-10_L3.0-W3.0-P0.50-LS5.0-BL
  oval 0.28x1.62 smd: 1(-1,-2.11) 2(-0.5,-2.11) 3(0,-2.11) 4(0.5,-2.11) 5(1,-2.11) 6(1,2.11) 7(0.5,2.11) 8(0,2.11) 9(-0.5,2.11) 10(-1,2.11)
R0603
  rect 0.806x0.864 smd: 1(-0.753,0) 2(0.753,0)
S8050_SOT-23
  rect 1x0.8 smd: 1(1.15,-0.823) 2(1.15,1.077) 3(-1.15,0.127)
SOD-123_L2.7-W1.6-LS3.7-RD-1
  rect 1.2x0.95 smd: 1(-1.7,0) 2(1.7,0)
SOD-523_L1.2-W0.8-LS1.6-BI
  rect 0.6x0.4 smd: 1(-0.75,0) 2(0.75,0)
SOT-23-3_L2.9-W1.3-P1.90-LS2.4-BR
  rect 1.25x0.7 smd: 1(1,-0.95) 2(1,0.95) 3(-1,0)
SW-SMD_TS36CA
  rect 1.45x0.8 smd: A(-3.375,-1.025) B(3.375,-1.025)
  rect 0.9x1 smd: C(-2.1,1.025) D(2.1,1.025)
TF-SMD_TF-15-15
  rect 1.6x0.701 smd: 1(-5.252,2.45) 2(-5.252,1.35) 3(-5.252,0.25) 4(-5.252,-0.85) 5(-5.252,-1.95) 6(-5.252,-3.05) 7(-5.252,-4.15) 8(-5.252,-5.25) 9(-5.252,-6.35)
  rect 1.6x1.8 smd: 10(-4.399,-8)
  rect 2.4x1.6 smd: 11(5.252,-7.6) 12(5.252,8)
  rect 1.399x1.801 smd: 13(-4.398,7.151)
TQFN-16_L3.0-W3.0-P0.50-BL-EP1.7
  rect 0.25x0.75 smd: 1(-0.749,-1.45) 2(-0.248,-1.45) 3(0.252,-1.45) 4(0.751,-1.45) 9(0.75,1.45) 10(0.25,1.45) 11(-0.25,1.45) 12(-0.749,1.45)
  rect 0.75x0.25 smd: 5(1.45,-0.75) 6(1.45,-0.25) 7(1.45,0.25) 8(1.45,0.75) 13(-1.45,0.75) 14(-1.45,0.25) 15(-1.45,-0.25) 16(-1.45,-0.75)
  rect 1.7x1.7 smd: 17(0.001,0)
TSOT-23-5_L2.9-W1.6-P0.95-LS2.8-BR
  rect 1.1x0.7 smd: 1(1.294,-0.951) 2(1.294,-0.001) 3(1.294,0.951) 4(-1.294,0.951) 5(-1.294,-0.949)
USB-C_SMD-TYPE-C-31-M-12
  oval 1.2x2 hole 0.8x1.6: 0(-4.325,1.706) 1(4.325,1.706)
  oval 1.2x1.8 hole 0.8x1.4: 2(4.325,-2.474) 3(-4.325,-2.474)
  rect 0.3x1.3 smd: A1(-3.35,2.474) A4(-2.55,2.474) A5(-1.25,2.474) A6(-0.25,2.474) A7(0.25,2.474) A8(1.25,2.474) A9(2.55,2.474) A12(3.35,2.474) B1(3.05,2.474) B4(2.25,2.474) B5(1.75,2.474) B6(0.75,2.474) B7(-0.75,2.474) B8(-1.75,2.474) B9(-2.25,2.474) B12(-3.05,2.474)
WIFIM-SMD_ESP32-S3-WROOM-1-N8
  rect 1.5x0.9 smd: 1(-8.9,8.954) 2(-8.9,7.684) 3(-8.9,6.415) 4(-8.9,5.144) 5(-8.9,3.874) 6(-8.9,2.604) 7(-8.9,1.335) 8(-8.9,0.065) 9(-8.9,-1.206) 10(-8.9,-2.475) 11(-8.9,-3.745) 12(-8.9,-5.016) 13(-8.9,-6.285) 14(-8.9,-7.556) 27(8.9,-7.556) 28(8.9,-6.285) 29(8.9,-5.016) 30(8.9,-3.745) 31(8.9,-2.475) 32(8.9,-1.206) 33(8.9,0.065) 34(8.9,1.335) 35(8.9,2.604) 36(8.9,3.874) 37(8.9,5.144) 38(8.9,6.415) 39(8.9,7.684) 40(8.9,8.954)
  rect 0.9x1.5 smd: 15(-6.985,-8.954) 16(-5.715,-8.954) 17(-4.445,-8.954) 18(-3.175,-8.954) 19(-1.905,-8.954) 20(-0.635,-8.954) 21(0.635,-8.954) 22(1.905,-8.954) 23(3.175,-8.954) 24(4.445,-8.954) 25(5.715,-8.954) 26(6.985,-8.954)
  rect 0.9x0.9 smd: 41(-2.9,2.635) 41(-2.9,1.235) 41(-2.9,-0.165) 41(-1.5,2.635) 41(-1.5,1.235) 41(-1.5,-0.165) 41(-0.1,2.635) 41(-0.1,1.235) 41(-0.1,-0.165)

## Nets
As in the schematic.

Pads without a net: TF1 9; U1 30; U3 10 11 14 15 16; USBC1 A8 B8; USBC2 A8 B8

## Via types
v1: diameter 0.61, hole 0.305, Top Layer to Bottom Layer, 259 vias
v2: diameter 0.508, hole 0.305, Top Layer to Bottom Layer, 2 vias

## Routing (per net, layer and track width the routed paths; a pad name or vN(x,y) marks a point on that pad's centre or on a via; arc(x,y) is an arc through that point)
3.3V: length 249.1
  Top Layer w0.254: U3.1 57.65,42.62 ; 57.65,42.62 56.65,42.62 C4.2 ; 57.65,42.62 58.48,42.62
  Top Layer w0.381: 17.11,43.06 14.7,43.06 14.19,42.55 14.19,41.77 9.24,41.77 ; 17.11,43.06 17.37,42.8 17.37,41.89 17.24,41.77 ; 17.11,43.06 18.76,43.06 ; 18.76,43.06 21.3,43.06 21.81,42.55 21.81,41.77 22.27,41.77 v1(23.11,42.6) ; 18.76,43.06 18.76,42.02 ; U2.1 v1(43.43,43.4) 42.14,42.1 C3.2 ; v1(74.77,42.3) 74.77,44.62 BUZZER1.1 72.21,47.18 C9.1
  Top Layer w0.508: 73.29,12.27 73.85,12.27 v1(74.36,11.76) 74.36,6.46 73.7,5.8 ; R29.1 R27.1 ; 76.13,5.78 76.13,4.91 75.35,4.14 ; 73.7,5.8 R22.2 ; 73.7,5.8 75.35,4.14 ; 56.76,20.19 52.64,20.19 52.6,20.15 v1(50.89,20.15) ; 56.76,20.19 56.76,18.09 57.36,17.49 57.36,16.59 ; 56.76,20.19 57.95,20.19 R30.1 59.56,20.09 ; v1(47.29,44.53) 48.05,44.53 48.41,44.17 48.41,42.38 49.15,41.63 54.86,41.63 55.84,42.61 C4.2 ; 9.24,8.72 9.29,8.77 ; 9.24,8.72 9.14,8.62 v1(9.14,7.75) ; 9.24,8.72 C14.2 ; v1(40.26,42.5) C2.1 C3.2 ; 75.35,4.14 75.35,2.34 C11.2 ; D9.1 74.77,44.37 ; 15.89,5.95 15.89,6.98 v1(15.89,6.99) ; R12.1 v1(34.53,40.26)
  Top Layer w0.635: C14.2 6.99,10.98 9.53,13.52 U1.2 ; 43.95,5.95 43.95,4.3 43.55,3.89 v1(43.38,3.89) 40.23,3.89 38.17,5.95 29.91,5.95 29.91,4.96 29.45,4.5 25.49,4.5 24.04,5.95 15.89,5.95
  Bottom Layer w0.381: v1(43.43,43.4) 46.15,43.4 v1(47.29,44.53) ; v1(58.77,42.45) 58.86,42.36 73.85,42.36 ; 73.85,42.36 74.62,41.59 74.62,25.53 73.84,24.76 CN4.4 68.47,24.76 68.47,23.96 71.92,23.96 ; 73.85,42.36 74.71,42.36 v1(74.77,42.3) ; v1(23.11,42.6) 25.8,42.6 27.42,40.97 33.82,40.97 v1(34.53,40.26) 36.77,42.5 v1(40.26,42.5)
  Bottom Layer w0.508: 68.47,24.39 67.58,24.39 66.13,22.94 63.33,20.14 v1(61.05,20.14)
  Bottom Layer w0.635: v1(50.89,20.15) 44.01,13.26 44.01,4.53 v1(43.38,3.89) ; v1(74.36,11.76) 74.36,14.71 66.13,22.94 ; v1(9.14,7.75) 9.9,6.99 v1(15.89,6.99)
+5V: length 78.9
  Top Layer w0.508: 81.1,7.78 81.12,7.76 81.12,6.58 79.6,6.58 79.2,6.18 79.2,5.58
  Top Layer w0.635: 75.84,13.54 63.34,13.54 57.6,7.8 42.05,7.8 41.45,7.2 41.45,5.95 ; 75.84,13.54 79.09,10.29 D7.1 81.1,9.54 81.1,7.98 ; 75.84,13.54 77.5,15.21 R17.1 ; 81.1,7.78 84.5,7.78 85.13,8.42 85.13,25.46 D1.1
GND: length 30.6
  Top Layer w0.254: 15.28,27.98 U1.41 ; 15.28,27.98 U1.41 16.68,27.98 ; 15.28,27.98 U1.41 ; 15.28,27.98 U1.41 15.28,26.58 ; U1.41 16.68,26.58 ; U1.41 15.28,26.58 ; U1.41 16.68,27.98 ; 16.68,26.58 U1.41 16.68,27.98 ; 16.68,26.58 U1.41 15.28,26.58 ; 16.68,26.58 U1.41 ; U2.8 40.5,44.94 ; 40.5,44.94 40.5,45.59 40.15,45.94 U2.6 ; 40.5,44.94 41.16,44.94 v1(41.36,45.13) ; 15.28,26.58 U1.41 ; C4.1 C5.1 ; 16.68,27.98 U1.41 ; v1(58.4,47.95) 58.15,47.71 U3.2
  Top Layer w0.381: TF1.6 55.16,15.02 v1(55.16,15.02)
  Top Layer w0.508: v1(78.27,13.85) 78.3,13.82 D5.2
  Top Layer w0.635: 40.2,5.95 40.2,5.08 40.63,4.65 42.36,4.65 42.7,5 42.7,5.95
  vias: v1(1.16,18.52) v1(1.16,16.43) v1(1.16,14.34) v1(1.16,12.25) v1(1.16,10.16) v1(1.16,8.06) v1(1.16,5.97) v1(5.68,53.93) v1(5.68,1.15) v1(7.05,1.15) v1(7.29,53.93) v1(8.42,1.15) v1(8.91,53.93) v1(10,12.83) v1(10.52,53.93) v1(12.13,53.93) v1(12.69,2.57) v1(12.69,1.55) v1(14.11,2.57) v1(14.11,1.55) v1(15.54,2.57) v1(15.54,1.55) v1(26.61,2.51) v1(26.61,1.49) v1(28.03,2.51) v1(28.03,1.49) v1(28.8,38.08) v1(28.8,36.91) v1(28.9,18.47) v1(28.9,17.1) v1(29.46,2.51) v1(29.46,1.49) v1(30.28,38.08) v1(30.28,36.91) v1(30.65,18.47) v1(30.65,17.1) v1(32.4,18.47) v1(32.4,17.1) v1(34.16,18.47) v1(34.16,17.1) v1(35.91,18.47) v1(35.91,17.1) v1(37.66,18.47) v1(37.66,17.1) v1(39.41,18.47) v1(39.41,17.1) v1(40.23,6.38) v1(40.66,2.46) v1(40.66,1.44) v1(40.89,37.72) v1(40.89,36.55) v1(41.17,18.47) v1(41.17,17.1) v1(42.08,2.46) v1(42.08,1.44) v1(42.61,37.72) v1(42.61,36.5) v1(42.71,6.38) v1(42.92,18.47) v1(42.92,17.1) v1(43.5,2.46) v1(43.5,1.44) v1(46.32,27.56) v1(46.32,26.24) v1(46.32,24.92) v1(47.34,43.11) v1(47.34,42.32) v1(48.49,27.56) v1(48.49,26.24) v1(48.49,24.92) v1(48.71,1.25) v1(50.65,27.56) v1(50.65,26.24) v1(50.65,24.92) v1(50.61,6.09) v1(51.22,1.25) v1(52.82,49.05) v1(52.82,27.56) v1(52.82,26.24) v1(52.82,24.92) v1(53.74,1.25) v1(54.5,31.98) v1(54.5,30.41) v1(54.86,53.93) v1(54.98,27.56) v1(54.98,26.24) v1(54.98,24.92) v1(55.69,30.41) v1(55.71,31.98) v1(56.25,1.25) v1(56.33,49.81) v1(56.78,31.98) v1(56.75,30.41) v1(56.88,53.93) v1(57.15,27.56) v1(57.15,26.24) v1(57.15,24.92) v1(58.77,1.25) v1(58.9,53.93) v1(59.31,27.56) v1(59.31,26.24) v1(59.31,24.92) v1(60.92,53.93) v1(61.28,1.25) v1(61.48,27.56) v1(61.48,26.24) v1(61.48,24.92) v1(62.94,53.93) v1(63.65,27.56) v1(63.65,26.24) v1(63.65,24.92) v1(63.75,11.87) v1(63.75,11.87) v1(63.75,10.85) v1(63.75,9.83) v1(63.8,1.25) v1(64.76,11.87) v1(64.76,10.85) v1(64.76,9.83) v1(64.96,53.93) v1(65.36,15.73) v1(66.21,6.09) v1(66.31,1.25) v1(66.98,53.93) v1(68.83,1.25) v1(69,53.93) v1(71.02,53.93) v1(71.34,1.25) v1(73.04,53.93) v1(73.85,1.25) v1(75.06,53.93) v1(76.04,9.22) v1(76.39,30.05) v1(76.45,32.85) v1(77.08,53.93) v1(77.97,9.17) v1(79.1,53.93) v1(80.05,30.05) v1(81.12,53.93) v1(83.14,53.93) v1(87.22,37.42) v1(87.22,36.4) v1(87.22,35.39) v1(87.22,18.88) v1(87.22,17.86) v1(87.22,16.84) v1(88.23,37.42) v1(88.23,36.4) v1(88.23,35.39) v1(88.23,35.39) v1(88.23,18.88) v1(88.23,17.86) v1(88.23,16.84) v1(88.23,16.84) v1(89.15,49.15) v1(89.15,47.34) v1(89.15,45.52) v1(89.15,43.7) v1(89.15,41.89) v1(89.15,30.97) v1(89.15,29.16) v1(89.15,27.36) v1(89.15,25.56) v1(89.15,23.75) v1(89.15,13.14) v1(89.15,11.32) v1(89.15,9.5) v1(89.15,7.69) v1(89.15,5.87) v2(50.21,15.68)
VBUSB: length 81.1
  Top Layer w0.254: USBC2.B4 82.47,20.57 82.69,20.35 84.12,20.35 84.47,19.99 84.47,17 83.76,16.29 82.69,16.29 82.47,16.07 USBC2.B9 ; C7.2 59.78,50.93 v1(59.53,50.68) 59.15,50.3 U3.9 ; USBC1.B9 82.47,34.2 82.64,34.37 84.23,34.37 85.34,35.47 85.34,37.22 84.17,38.38 82.85,38.38 82.6,38.64 82.06,38.64 USBC1.A9 ; U3.3 58.65,44.44 59.78,43.31 59.78,42.32 62,42.32 63.44,43.77 63.44,45.95 v1(61.71,47.68)
  Top Layer w0.508: D2.1 78.3,28.89 D1.2
  Top Layer w0.635: D1.2 78.33,28.68 78.33,22.69 80.26,20.76 80.96,20.76 ; 59.78,42.32 59.78,40.21 68.57,31.42 D2.1 78.3,32.32 80,34.01 80.96,34.01
  Bottom Layer w0.508: v1(61.71,47.68) 61.71,48.5 v1(59.53,50.68)
VBUSB_OTG: length 8.6
  Top Layer w0.508: D7.2 82.26,10.29 80.75,11.8 80.75,13.14 80.41,13.14 ; D5.1 80.41,13.14 ; 80.41,13.14 79.01,14.53 R17.2
BK_CTRL: length 2.8
  Top Layer w0.381: U1.31 19.69,39.03 20.29,39.63 R16.1
BUZZER: length 69.8
  Top Layer w0.254: R20.1 67.3,47.02 v1(66.21,47.02)
  Top Layer w0.508: v1(14.57,36.1) 14.61,36.13 U1.35
  Bottom Layer w0.254: v1(66.21,47.02) 65.6,46.41 49.27,46.41 48.1,47.58 15.99,47.58 11,42.59 11,38.09 13.05,36.05 14.52,36.05 v1(14.57,36.1)
CC1: length 3.4
  Top Layer w0.254: USBC1.A5 78.34,35.2 78.3,35.16
CC1_1: length 2.7
  Top Layer w0.254: USBC2.A5 79.07,17.07 R18.1
CC2: length 3.5
  Top Layer w0.254: R13.1 USBC1.B5
CC2_1: length 2.5
  Top Layer w0.254: 79.17,20.05 79.19,20.07 USBC2.B5
CHIP_PU: length 84.2
  Top Layer w0.254: v1(14.93,49.66) C6.2
  Top Layer w0.381: v1(14.93,49.66) 17.19,49.66 19.27,51.75 22.98,48.04 49.24,48.04 50.41,46.87 Q1.3
  Top Layer w0.508: 10.79,8.77 10.69,8.87 C15.2 10.8,10.91 U1.3 v1(10.8,21.56) 10.81,21.57
  Bottom Layer w0.254: v1(10.8,21.56) 8.83,23.52 8.83,43.82 14.67,49.66 v1(14.93,49.66)
DTR: length 10.8
  Top Layer w0.254: U3.12 57.65,50.67 55.95,52.38 R6.1 53.58,53.62 51.76,53.62 50.51,52.37 Q2.3
FB: length 8.8
  Top Layer w0.508: 79.66,4.14 R23.1 76.86,2.44 C11.1 ; 79.66,4.14 81.1,5.58 ; 79.66,4.14 80.4,3.4 R24.2
GPIO0: length 77.1
  Top Layer w0.254: 46.9,52.07 v1(46.9,50.58)
  Top Layer w0.381: v1(24.78,36.1) 24.77,36.11 U1.27 ; v1(12.29,40.26) R7.2 ; v1(12.34,42.75) 12.34,43.57 v1(11.73,44.17) 9.99,45.92 C1.2 6.31,45.92 3.79,45.92
  Bottom Layer w0.254: v1(52.81,52.64) 52.5,52.64 50.44,50.58 v1(46.9,50.58) 44.36,48.04 15.59,48.04 v1(11.73,44.17)
  Bottom Layer w0.381: v1(24.78,36.1) 24.78,36.5 23.08,38.21 11.9,38.21 11.42,38.69 11.42,39.4 v1(12.29,40.26) 12.34,40.31 v1(12.34,42.75)
IO1: length 35.1
  Top Layer w0.254: v1(28.19,50.73) 28.48,51.02 28.48,52.07
  Top Layer w0.381: R2.2 9.24,39.63 9.53,39.34 U1.39 9.53,36.08 v1(9.49,36.05)
  Bottom Layer w0.254: v1(9.49,36.05) 9.49,43.72 14.85,49.08 26.53,49.08 v1(28.19,50.73)
IO2: length 43.5
  Top Layer w0.254: 37.5,52.07 37.5,50.9 v1(37.33,50.73)
  Top Layer w0.381: v1(10.81,36) 10.8,36.01 U1.38 10.8,40.22 R4.2
  Bottom Layer w0.254: v1(37.33,50.73) 35.15,48.54 15.23,48.54 10.25,43.57 10.25,36.55 v1(10.81,36)
IO3: length 52
  Top Layer w0.381: v1(28.85,21.82) 26.19,21.82 U1.15
  Bottom Layer w0.381: CN4.19 54.63,36.76 48.35,30.48 41.11,30.48 32.45,21.82 v1(28.85,21.82)
IO4: length 13.8
  Top Layer w0.381: U1.4 12.07,6.07
IO5: length 13.8
  Top Layer w0.381: U1.5 13.34,6.05
IO6: length 62.9
  Top Layer w0.254: U1.6 14.61,12.64 18.69,8.56 56.84,8.56 60.66,12.39 60.66,18.19 R27.2
IO7: length 59.1
  Top Layer w0.254: U1.7 15.88,13.1 19.6,9.38 55.92,9.38 59.56,13.01 R29.2
IO8: length 74.3
  Top Layer w0.381: v1(67.5,30.36) 67.5,30.66 v1(60.6,37.57)
  Top Layer w0.508: U1.12 v1(22.23,17.86)
  Bottom Layer w0.381: v1(67.5,30.36) 66.84,29.7 41.55,29.7 32.35,20.5 28.85,20.5 25.65,17.3 22.79,17.3 v1(22.23,17.86) ; CN4.20 71.91,37.57 v1(60.6,37.57)
IO9: length 50.2
  Top Layer w0.381: v1(49.24,32.64) v1(52.67,32.64) ; v1(28.85,24.36) 26.19,24.36
  Bottom Layer w0.381: 71.92,35.16 55.18,35.16 v1(52.67,32.64) ; v1(49.24,32.64) 40.66,32.64 32.38,24.36 28.92,24.36 28.87,24.41
IO10: length 49.4
  Top Layer w0.381: v1(28.85,25.63) 26.19,25.63 U1.18 ; v1(54.45,33.41) v1(49.88,33.41)
  Bottom Layer w0.381: 71.92,34.36 55.4,34.36 v1(54.45,33.41) ; v1(49.88,33.41) 40.2,33.41 32.43,25.63 28.87,25.63
IO11: length 49
  Top Layer w0.381: v1(56.86,33.66) 56.35,34.17 v1(50.26,34.17) ; v1(28.85,26.9) 28.82,26.88 U1.19
  Bottom Layer w0.381: v1(56.86,33.66) 56.97,33.56 CN4.15 ; v1(50.26,34.17) 39.74,34.17 32.48,26.9 28.92,26.9
IO12: length 49.5
  Top Layer w0.381: v1(50.64,34.93) 56.61,34.93 v1(58.77,32.77) ; v1(28.85,28.17) 26.19,28.17 U1.20
  Bottom Layer w0.381: v1(50.64,34.93) 39.13,34.93 32.38,28.17 28.82,28.17 ; CN4.14 58.78,32.76 v1(58.77,32.77)
IO13: length 49.9
  Top Layer w0.381: v1(51.02,35.69) 56.99,35.69 60.67,32.01 ; U1.21 28.82,29.42 v1(28.85,29.44)
  Bottom Layer w0.381: 71.92,31.96 60.72,31.96 v1(60.67,32.01) ; v1(51.02,35.69) 38.68,35.69 32.43,29.44 28.87,29.44
IO14: length 50.8
  Top Layer w0.381: U1.22 26.19,30.71 v1(28.85,30.71)
  Bottom Layer w0.381: 28.92,30.71 32.48,30.71 41.42,39.65 55.01,39.65 58.51,43.16 71.92,43.16
IO15: length 55.7
  Top Layer w0.254: U1.8 17.15,13.4 20.36,10.19 55.11,10.19 58.46,13.54 58.46,18.17 R30.2
IO16: length 49.3
  Top Layer w0.254: U1.9 18.42,13.91 21.23,11.1 54.25,11.1 56.26,13.12 56.26,16.59
IO17: length 46.9
  Top Layer w0.254: R25.2 54.45,18.66 54.45,18.01 54.06,17.62 54.06,13.46 52.77,12.17 21.63,12.17 19.69,14.12 U1.10
IO18: length 43.2
  Top Layer w0.254: U1.11 20.96,14.47 22.34,13.09 51.96,13.09 52.87,14 52.87,16.5 52.96,16.59 52.96,17.62 52.57,18.01 52.57,18.66 R26.2
IO21: length 50.8
  Top Layer w0.381: U1.23 26.19,31.98 v1(28.85,31.98) 28.8,31.93
  Bottom Layer w0.381: 28.82,32.03 32.38,32.03 40.56,40.21 54.6,40.21 58.35,43.96 71.92,43.96
IO35: length 35.7
  Top Layer w0.508: U1.28 23.46,37.65 v1(23.46,36.15) ; v1(27.42,7.09) 27.42,5.97 27.41,5.95
  Bottom Layer w0.381: v1(27.42,7.09) 27.42,8.56 20.67,15.32 20.67,18.47 23.46,21.26 v1(23.46,36.15)
IO36: length 35.4
  Top Layer w0.508: v1(26.15,7.14) 26.15,5.95 26.16,5.95 ; v1(22.24,36.15) 22.24,37.67 U1.29
  Bottom Layer w0.381: v1(22.24,36.15) 22.24,21.21 19.75,18.72 19.75,15.07 26.15,8.67 v1(26.15,7.14)
IO39: length 26.1
  Top Layer w0.254: U2.10 38.51,43.94 37.94,43.36 v1(37.53,43.36)
  Top Layer w0.381: U1.32 18.42,39.03 18.76,39.37 v1(18.76,40.26)
  Bottom Layer w0.254: v1(37.53,43.36) 19.55,43.36 18.76,42.57 v1(18.76,40.26)
IO40: length 28.5
  Top Layer w0.254: v1(37.53,44.43) 37.54,44.44 U2.9
  Top Layer w0.381: 17.37,40.26 17.15,40.26 U1.33
  Bottom Layer w0.254: v1(17.24,40.21) 17.24,43.64 18.03,44.43 v1(37.53,44.43)
IO41: length 2.6
  Top Layer w0.381: 15.97,40.26 15.88,40.17 U1.34
IO45: length 47.7
  Top Layer w0.381: U1.26 28.82,35.77 v1(28.85,35.79) 31.89,35.79 36.57,31.12 v1(61.18,31.12)
  Bottom Layer w0.381: 71.92,31.16 61.22,31.16 v1(61.18,31.12)
IO46: length 51.1
  Top Layer w0.381: v1(28.85,23.09) 26.24,23.09 26.19,23.04 ; v1(48.61,31.88) v1(50.89,31.88)
  Bottom Layer w0.381: 28.82,23.09 28.87,23.04 32.33,23.04 41.17,31.88 v1(48.61,31.88) ; v1(50.89,31.88) 54.97,35.96 71.92,35.96
IO47: length 50
  Top Layer w0.381: v1(54.09,40.92) 55.01,40.92 57.5,38.43 v1(58.77,38.43) ; v1(28.85,33.25) 28.82,33.23 U1.24
  Bottom Layer w0.381: 71.92,38.36 58.85,38.36 v1(58.77,38.43) ; v1(54.09,40.92) 40.02,40.92 32.35,33.25 v1(28.85,33.25)
IO48: length 49.8
  Top Layer w0.381: U1.25 28.64,34.5
  Bottom Layer w0.254: v1(28.85,34.52) 32.66,34.52 39.72,41.58 55.26,41.58 58.43,44.76 CN4.29
LED_A: length 44.6
  Top Layer w0.254: v1(68.83,30.41) 67.96,29.54 66.13,29.54 59.02,36.66 48.16,36.66 47.75,36.25 45.86,36.25 42.71,39.4 36.67,39.4 34.3,41.77 33.11,41.77
  Bottom Layer w0.254: 71.92,30.36 68.88,30.36 v1(68.83,30.41)
LED_K: length 69.3
  Top Layer w0.254: R33.2 31.41,39.55 31.92,39.04 42.56,39.04 45.71,35.89 47.9,35.89 48.3,36.3 58.87,36.3 v1(67.56,27.61) 67.61,27.61
  Top Layer w0.508: R14.2 R32.2 R33.2
  Bottom Layer w0.381: 68.75,28.76 68.52,28.53 68.52,27.96 ; 68.75,28.76 69.55,29.56 CN4.10 ; 68.75,28.76 CN4.9 ; 68.71,26.36 69.51,25.56 CN4.5 ; 68.71,26.36 68.52,26.55 68.52,27.06 ; 68.71,26.36 71.92,26.36 ; 68.52,27.96 71.92,27.96 ; 68.52,27.96 68.52,27.66 ; v1(67.56,27.61) 68.47,27.61 68.52,27.66 ; 68.52,27.06 68.52,27.66 ; 68.52,27.06 68.61,27.16 71.92,27.16
LX: length 3.2
  Top Layer w0.508: L1.2 79,7.58 79.2,7.78
RTS: length 6.4
  Top Layer w0.254: 54.86,46.2 55.87,47.21 55.87,48.09 56.49,48.7 U3.13
  Top Layer w0.381: 54.86,46.2 53.24,47.82 Q1.2
RXD0: length 61.3
  Top Layer w0.203: U3.4 59.15,45.77 v2(59.22,45.7)
  Top Layer w0.508: U1.36 13.35,37.7 v1(13.35,39.04)
  Bottom Layer w0.254: v1(13.35,39.04) 13.61,39.3 13.61,43.26 16.4,46.05 25.11,46.05 arc(25.25,46.11) 25.3,46.24 25.3,46.58 arc(25.5,46.77) 25.69,46.58 25.69,46.24 arc(25.88,46.05) 26.07,46.24 26.07,46.58 arc(26.26,46.77) 26.45,46.58 26.45,46.24 arc(26.64,46.05) 26.83,46.24 26.83,46.58 arc(27.02,46.77) 27.21,46.58 27.21,46.24 arc(27.4,46.05) 27.59,46.24 27.59,46.58 arc(27.78,46.77) 27.97,46.58 27.97,46.24 arc(28.16,46.05) 28.35,46.24 28.35,46.58 arc(28.54,46.77) 28.73,46.58 28.73,46.24 arc(28.92,46.05) 29.11,46.24 29.11,46.58 arc(29.31,46.77) 29.5,46.58 29.5,46.24 arc(29.55,46.11) 29.69,46.05 49.78,46.05 51.71,44.12 v1(53.33,44.12) 53.69,44.12 55.27,45.7 v2(59.22,45.7)
TP_IRQ: length 28.5
  Top Layer w0.254: U2.7 37.54,45.44 v1(37.53,45.44) ; v1(15.71,41.77) 14.21,40.26 R5.1
  Bottom Layer w0.254: v1(15.71,41.77) 15.71,44.05 17.11,45.44 v1(37.53,45.44)
TXD0: length 61.4
  Top Layer w0.254: v1(49.32,45.34) 49.32,45.44 v1(48,46.77) ; U3.5 60.46,47.2 60.75,46.92 v1(60.75,45.7)
  Top Layer w0.508: v1(12.13,39.04) 12.13,37.75 U1.37
  Bottom Layer w0.254: v1(12.13,39.04) 13,39.91 13,43.72 16.45,47.17 47.59,47.17 v1(48,46.77) ; v1(60.75,45.7) 60.22,45.17 56.05,45.17 v1(53.33,42.45) 53.13,42.24 52.42,42.24 v1(49.32,45.34)
USB1_DN: length 69.9
  Top Layer w0.127: U1.13 23.5,19.07 23.99,18.57 23.99,18 26.25,15.74 44.99,15.74 50.82,21.57 63.72,21.57 66.61,18.68 76.08,18.68 ; 76.08,18.68 76.13,18.63 ; 76.08,18.68 76.13,18.63 ; 76.13,18.63 D8.1 ; USBC2.A7 80.98,18.57 80.87,18.68 76.17,18.68
  Top Layer w0.254: USBC2.A7 81.7,18.57 v1(83.46,18.57) ; v1(83.46,17.1) 82.94,17.1 82.47,17.57 USBC2.B7
  Bottom Layer w0.254: v1(83.46,17.1) v1(83.46,18.57)
USB1_DP: length 70.3
  Top Layer w0.127: U1.14 24.77,19.07 24.27,18.57 24.27,18.12 26.37,16.02 44.87,16.02 50.7,21.85 63.84,21.85 66.73,18.96 76.08,18.96 76.13,19 D6.1 ; USBC2.B6 80.98,19.07 80.87,18.96 76.17,18.96
  Top Layer w0.254: USBC2.B6 82.78,19.07 83.05,19.33 83.81,19.33 84.07,19.08 84.07,18.11 83.78,17.82 82.94,17.82 82.68,18.08 81.7,18.08 USBC2.A6
USB_DN: length 37.5
  Top Layer w0.127: USBC1.A7 80.98,36.7 80.87,36.59 76.57,36.59 76.53,36.64 ; U3.8 60.29,48.7 60.4,48.59 63.09,48.59 65.57,46.11 65.57,39.25 68.23,36.59 76.48,36.59 76.53,36.64 ; 76.53,36.64 D4.1
  Top Layer w0.254: USBC1.A7 81.7,36.71 v1(83.91,36.71) ; USBC1.B7 82.99,35.7 83.46,35.23 v1(83.96,35.23)
  Bottom Layer w0.254: v1(83.96,35.23) 83.91,35.28 v1(83.91,36.71)
USB_DP: length 38.9
  Top Layer w0.127: 76.53,36.27 76.57,36.31 80.87,36.31 80.98,36.2 USBC1.A6 ; 76.53,36.27 D3.1 ; 76.53,36.27 76.48,36.31 68.11,36.31 65.3,39.13 65.3,45.99 62.97,48.32 60.4,48.32 60.29,48.2 U3.7
  Top Layer w0.254: USBC1.B6 83.19,37.2 83.61,37.62 84.17,37.62 84.7,37.09 84.7,36.36 84.23,35.89 83.6,35.89 83.25,36.25 81.74,36.25 USBC1.A6
X+: length 34.9
  Top Layer w0.254: v1(44.64,38.99) 44.64,44.23 44.43,44.44 U2.2
  Bottom Layer w0.254: v1(44.64,38.99) 55.67,38.99 58.23,41.56 CN4.25
X-: length 36.8
  Top Layer w0.254: U2.4 45.21,45.44 45.91,44.73 v1(45.91,37.67)
  Bottom Layer w0.254: 71.92,39.96 58.56,39.96 56.28,37.67 v1(45.91,37.67)
Y+: length 35.9
  Top Layer w0.254: U2.3 44.9,44.94 45.31,44.53 v1(45.31,38.33)
  Bottom Layer w0.254: CN4.24 58.4,40.76 55.97,38.33 v1(45.31,38.33)
Y-: length 37.7
  Top Layer w0.254: v1(46.52,37.06) 46.52,45.04 45.63,45.94 U2.5
  Bottom Layer w0.254: v1(46.52,37.06) 46.64,37.18 56.54,37.18 58.52,39.16 71.92,39.16
$1N3208: length 16.3
  Top Layer w0.381: Q4.3 75.95,47.63 79.72,47.63 81.93,45.43 BUZZER1.2
  Top Layer w0.508: D9.2 81.93,44.11 BUZZER1.2
$1N3424: length 5.6
  Top Layer w0.381: R20.2 67.4,51 68.38,51 Q4.1
$1N5196: length 4
  Top Layer w0.254: C8.2 62.72,45.61 60.62,47.7 U3.6
$1N5808: length 3.9
  Top Layer w0.381: R8.2 54.86,48.69 Q2.1
$1N5811: length 9.5
  Top Layer w0.381: Q1.1 51.53,47.2 51.53,50.93 52.29,51.69 54.01,51.69 R6.2
$1N5919: length 1.8
  Top Layer w0.305: 49.87,44.17 51.64,44.17 51.69,44.13
$1N6009: length 1.8
  Top Layer w0.305: 51.69,42.35 49.94,42.35 49.91,42.38
$1N10155: length 5.4
  Top Layer w0.381: 20.29,41.77 21.79,40.26 R15.2 23.51,41.96 24.37,41.96
$1N10331: length 5.4
  Top Layer w0.381: Q3.3 27.41,41.01 28.16,41.77 31.41,41.77
$1N12322: length 1.8
  Top Layer w0.508: R22.1 71.27,7.54 LED3.2

## Copper pours and planes (outline as drawn; the poured copper is in the pictures)
GND on Top Layer: -0.31,-0.33 90.26,-0.33 90.26,55.2 -0.31,55.2
GND on Bottom Layer: -0.77,55.71 90.72,55.71 90.72,-0.73 -0.77,-0.73

Small or netless copper shapes (teardrops, artwork), in the pictures only: 293 on Top Layer, 107 on Bottom Layer

## Text on the board
Top Silkscreen Layer: IO4 | IO5 | GND | 3.3V | IO36 | IO35 | 5V | ESP32-S3 to TFT3.2 LVGL / 2023-11-25 V1.0 / By XiaoFeiZai | COM | OTG
